# EAGLE design Amstrad-CPC-Z80-CTC-2-0 (EAGLE 9.6.2)
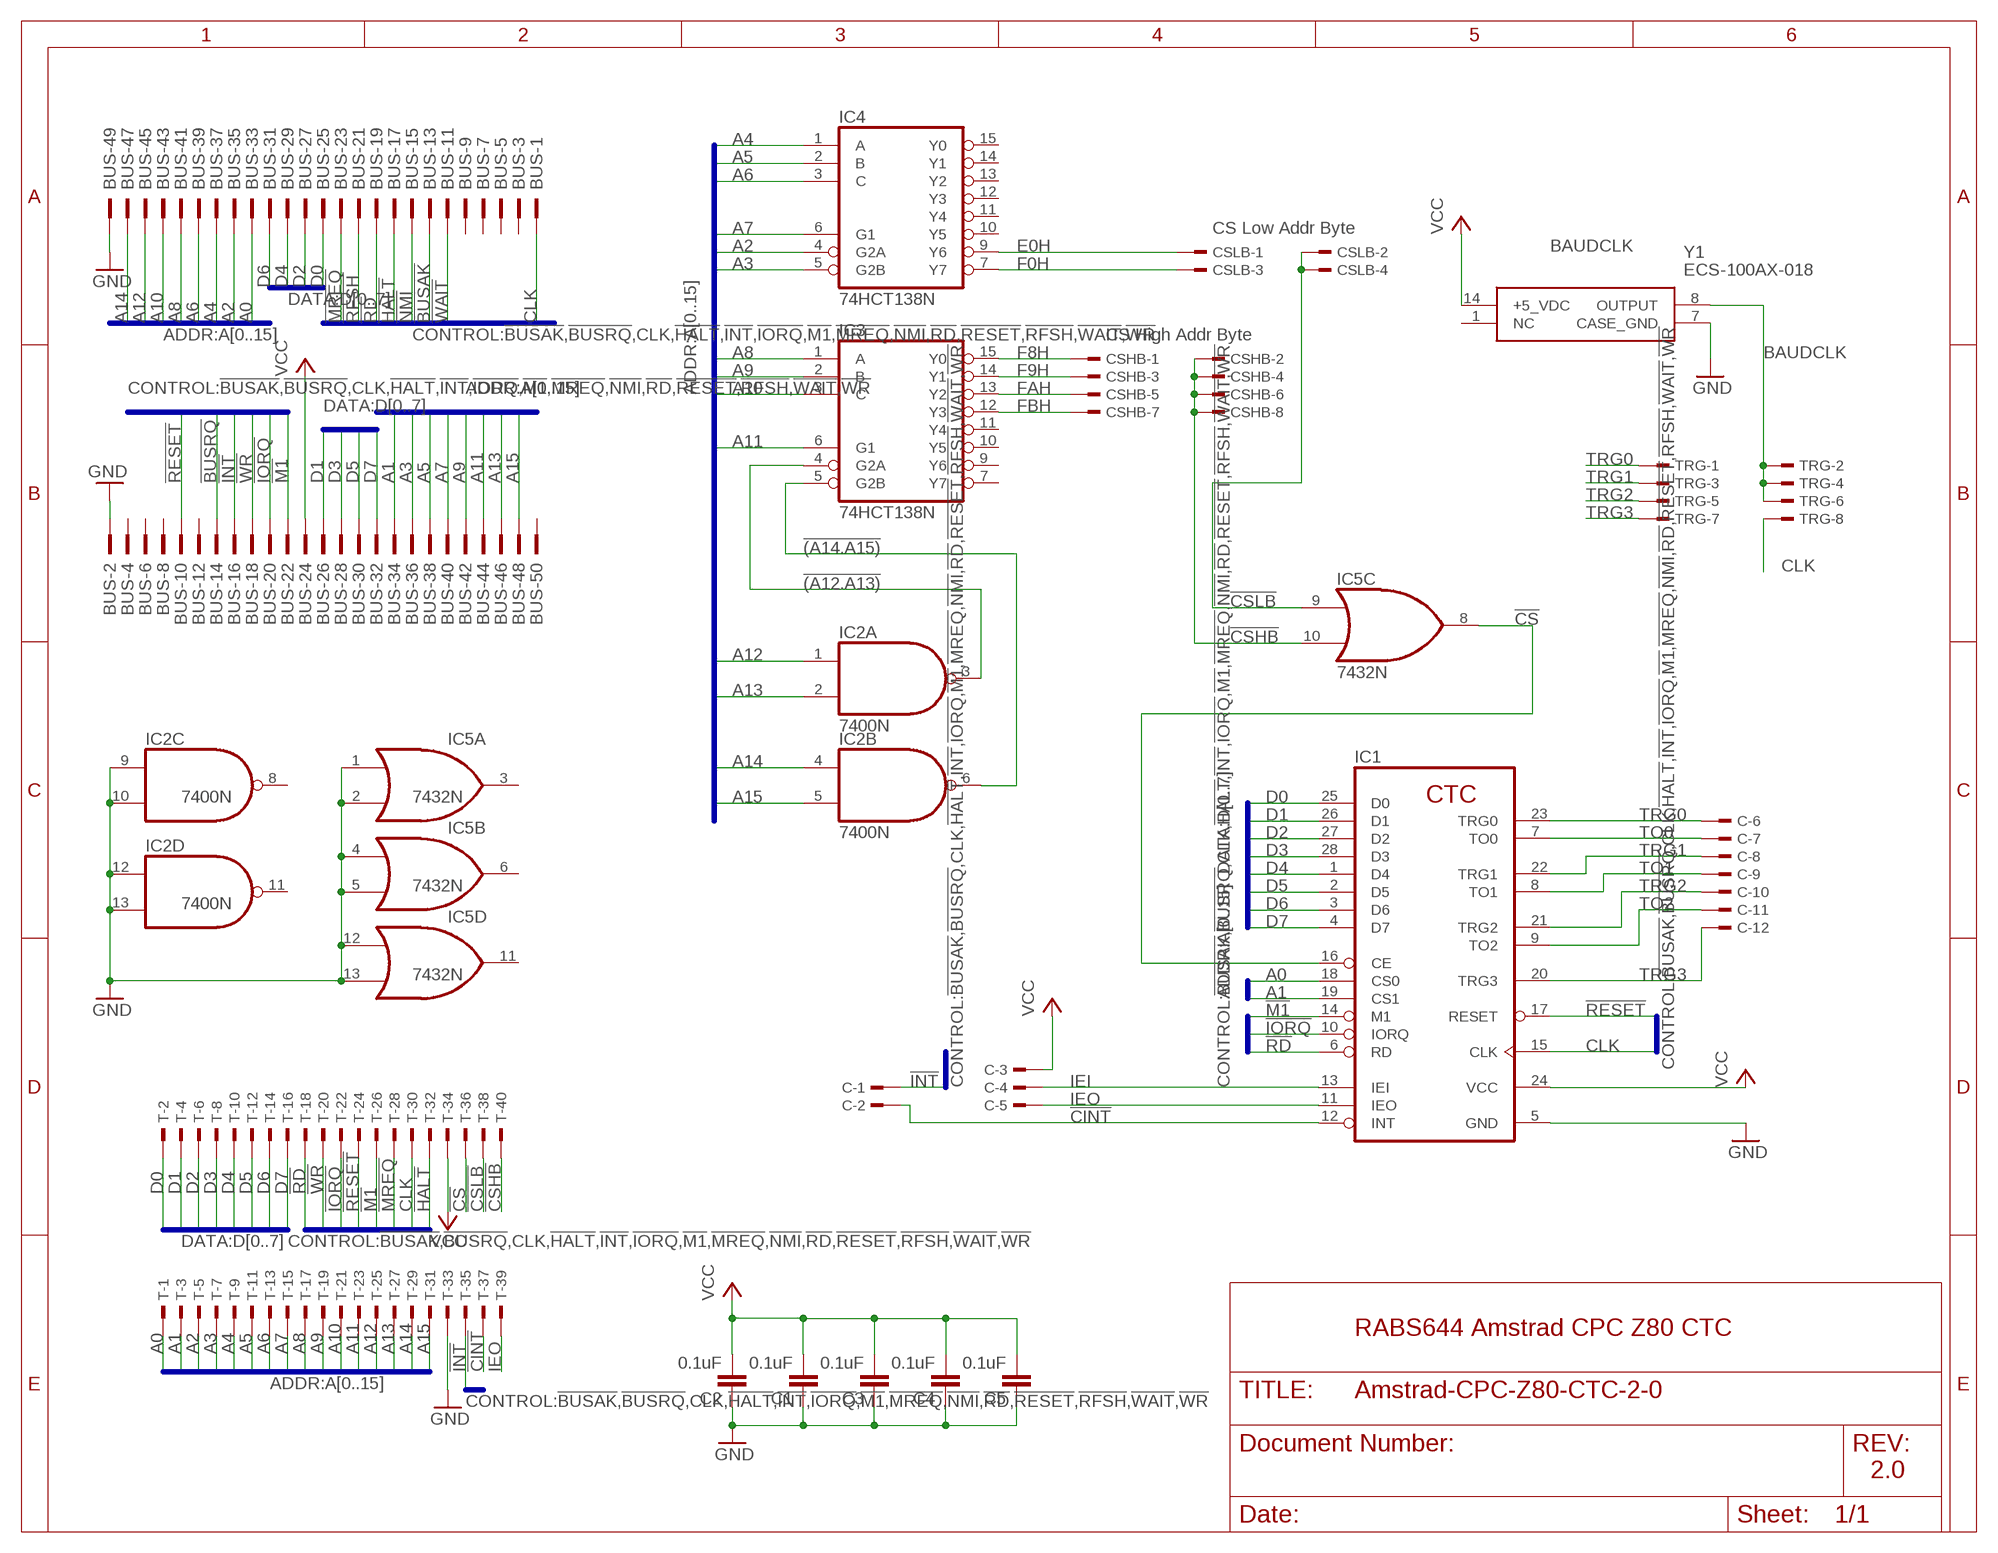
[diagram p0: schematic, sheet 1]

## Parts
BUS  2550-  [PAK100/2500-50]
C  TSW-112-07-G-S  [TSW-112-XX-G-S]
C1  0.1uF  C-EU050-025X075  [C050-025X075]
C2  0.1uF  C-EU050-025X075  [C050-025X075]
C3  0.1uF  C-EU050-025X075  [C050-025X075]
C4  0.1uF  C-EU050-025X075  [C050-025X075]
C5  0.1uF  C-EU050-025X075  [C050-025X075]
CSHB  TSW-104-07-G-D  [TSW-104-XX-G-D]
CSLB  TSW-102-07-G-D  [TSW-102-XX-G-D]
IC1  Z80CTC  [DIL28]
IC2  7400N  [DIL14]
IC3  74HCT138N  [DIL16]
IC4  74HCT138N  [DIL16]
IC5  7432N  [DIL14]
T  TSW-120-07-G-D  [TSW-120-XX-G-D]
TRG  TSW-104-07-G-D  [TSW-104-XX-G-D]
Y1  ECS-100AX-018  [ECS100AX018]

## Nets
!(A12.A13): IC2.3(A:O) IC3.4(G2A)
!(A14.A15): IC2.6(B:O) IC3.5(G2B)
!BUSAK: BUS.13
!BUSRQ: BUS.14
!CINT: C.2 IC1.12(INT) T.37
!CS: IC1.16(CE) IC5.8(C:O) T.36
!CSHB: CSHB.2 CSHB.4 CSHB.6 CSHB.8 IC5.10(C:I1) T.40
!CSLB: CSLB.2 CSLB.4 IC5.9(C:I0) T.38
!HALT: BUS.17 T.32
!INT: BUS.16 C.1 T.35
!IORQ: BUS.20 IC1.10(IORQ) T.22
!M1: BUS.22 IC1.14(M1) T.26
!MREQ: BUS.23 T.28
!NMI: BUS.15
!RD: BUS.19 IC1.6(RD) T.18
!RESET: BUS.10 IC1.17(RESET) T.24
!RFSH: BUS.21
!WAIT: BUS.11
!WR: BUS.18 T.20
A0: BUS.33 IC1.18(CS0) T.1
A1: BUS.34 IC1.19(CS1) T.3
A2: BUS.35 IC4.4(G2A) T.5
A3: BUS.36 IC4.5(G2B) T.7
A4: BUS.37 IC4.1(A) T.9
A5: BUS.38 IC4.2(B) T.11
A6: BUS.39 IC4.3(C) T.13
A7: BUS.40 IC4.6(G1) T.15
A8: BUS.41 IC3.1(A) T.17
A9: BUS.42 IC3.2(B) T.19
A10: BUS.43 IC3.3(C) T.21
A11: BUS.44 IC3.6(G1) T.23
A12: BUS.45 IC2.1(A:I0) T.25
A13: BUS.46 IC2.2(A:I1) T.27
A14: BUS.47 IC2.4(B:I0) T.29
A15: BUS.48 IC2.5(B:I1) T.31
BAUDCLK: TRG.2 TRG.4 TRG.6 Y1.8(OUTPUT)
CLK: BUS.1 IC1.15(CLK) T.30 TRG.8
D0: BUS.25 IC1.25(D0) T.2
D1: BUS.26 IC1.26(D1) T.4
D2: BUS.27 IC1.27(D2) T.6
D3: BUS.28 IC1.28(D3) T.8
D4: BUS.29 IC1.1(D4) T.10
D5: BUS.30 IC1.2(D5) T.12
D6: BUS.31 IC1.3(D6) T.14
D7: BUS.32 IC1.4(D7) T.16
E0H: CSLB.1 IC4.9(Y6)
F0H: CSLB.3 IC4.7(Y7)
F8H: CSHB.1 IC3.15(Y0)
F9H: CSHB.3 IC3.14(Y1)
FAH: CSHB.5 IC3.13(Y2)
FBH: CSHB.7 IC3.12(Y3)
GND [supply]: BUS.2 BUS.49 C1.1 C2.1 C3.1 C4.1 C5.1 IC1.5(GND) IC2.9(C:I0) IC2.10(C:I1) IC2.12(D:I0) IC2.13(D:I1) IC5.1(A:I0) IC5.2(A:I1) IC5.4(B:I0) IC5.5(B:I1) IC5.12(D:I0) IC5.13(D:I1) T.33 Y1.7(CASE_GND)
IEI: C.4 IC1.13(IEI)
IEO: C.5 IC1.11(IEO) T.39
TO0: C.7 IC1.7(TO0)
TO1: C.9 IC1.8(TO1)
TO2: C.11 IC1.9(TO2)
TRG0: C.6 IC1.23(TRG0) TRG.1
TRG1: C.8 IC1.22(TRG1) TRG.3
TRG2: C.10 IC1.21(TRG2) TRG.5
TRG3: C.12 IC1.20(TRG3) TRG.7
VCC [supply]: BUS.24 C1.2 C2.2 C3.2 C4.2 C5.2 C.3 IC1.24(VCC) T.34 Y1.14(+5_VDC)
Unconnected: BUS.3 BUS.4 BUS.5 BUS.6 BUS.7 BUS.8 BUS.9 BUS.12 BUS.50 IC2.8(C:O) IC2.11(D:O) IC3.7(Y7) IC3.9(Y6) IC3.10(Y5) IC3.11(Y4) IC4.10(Y5) IC4.11(Y4) IC4.12(Y3) IC4.13(Y2) IC4.14(Y1) IC4.15(Y0) IC5.3(A:O) IC5.6(B:O) IC5.11(D:O) Y1.1(NC)

## Buses
ADDR:A[0..15]
DATA:D[0..7]
CONTROL:!BUSAK,!BUSRQ,CLK,!HALT,!INT,!IORQ,!M1,!MREQ,!NMI,!RD,!RESET,!RFSH,!WAIT,!WR

## Notes on the sheet
- CS Low Addr Byte
- BAUDCLK
- CS High Addr Byte
- RABS644 Amstrad CPC Z80 CTC
- 2.0

## Power pins joined to a net without a drawn wire
GND: IC2.7(P:GND) IC3.8(GND) IC4.8(GND) IC5.7(P:GND)
VCC: IC2.14(P:VCC) IC3.16(VCC) IC4.16(VCC) IC5.14(P:VCC)

## Library data of the parts
BUS = con-3m:2550-: 3M (TM) Pak 100 4-Wall Header Source: 3M; OC_FARNELL: unknown; OC_NEWARK: unknown; SPICEPREFIX: X
C = con-samtec:TSW-112-*-G-S: THROUGH-HOLE .025" SQ POST HEADER Source: Samtec TSW.pdf; MF: Samtec Inc.; MPN: TSW-112-07-G-S
C1-C5 = rcl:C-EU: CAPACITOR, European symbol; SPICEPREFIX: C
CSHB TRG = con-samtec:TSW-104-*-G: THROUGH-HOLE .025" SQ POST HEADER Source: Samtec TSW.pdf; MF: Samtec Inc.; MPN: TSW-104-07-G-D
CSLB = con-samtec:TSW-102-*-G: THROUGH-HOLE .025" SQ POST HEADER Source: Samtec TSW.pdf; MF: Samtec Inc.; MPN: TSW-102-07-G-D
IC1 = zilog:Z80CTC: Z80 FAMILY DEVICE
IC2 = 74xx-us:74*00: Quad 2-input NAND gate
IC3 IC4 = 74xx-eu:74*138: 3-line to 8-line DECODER/DEMULTIPLEXER
IC5 = 74xx-us:74*32: Quad 2-input OR gate
T = con-samtec:TSW-120-*-G: THROUGH-HOLE .025" SQ POST HEADER Source: Samtec TSW.pdf; MF: Samtec Inc.; MPN: TSW-120-07-G-D
Y1 = ECS-100AX-018:ECS-100AX-018: Standard Clock Oscillators DIP-14 5V 1.8432MHz Source: Datasheet <https://ecsxtal.com/store/pdf/ecs-100x.pdf>; ARROW_PART_NUMBER: ECS-100AX-018; ARROW_PRICE-STOCK: https://www.arrow.com/en/products/ecs-100ax-018/ecs-international?region=nac; DESCRIPTION: Standard Clock Oscillators DIP-14 5V 1.8432MHz; HEIGHT: 5.08mm; MANUFACTURER_NAME: ECS; MANUFACTURER_PART_NUMBER: ECS-100AX-018; MOUSER_PART_NUMBER: 520-TCF184-X; MOUSER_PRICE-STOCK: https://www.mouser.co.uk/ProductDetail/ECS/ECS-100AX-018?qs=GxOUx7aO6ny8sWJWBQEujw%3D%3D

## Net classes
0 default: width 0.254 mm, clearance 0.254 mm
1 supply: width 0.508 mm, clearance 0.508 mm

## Board
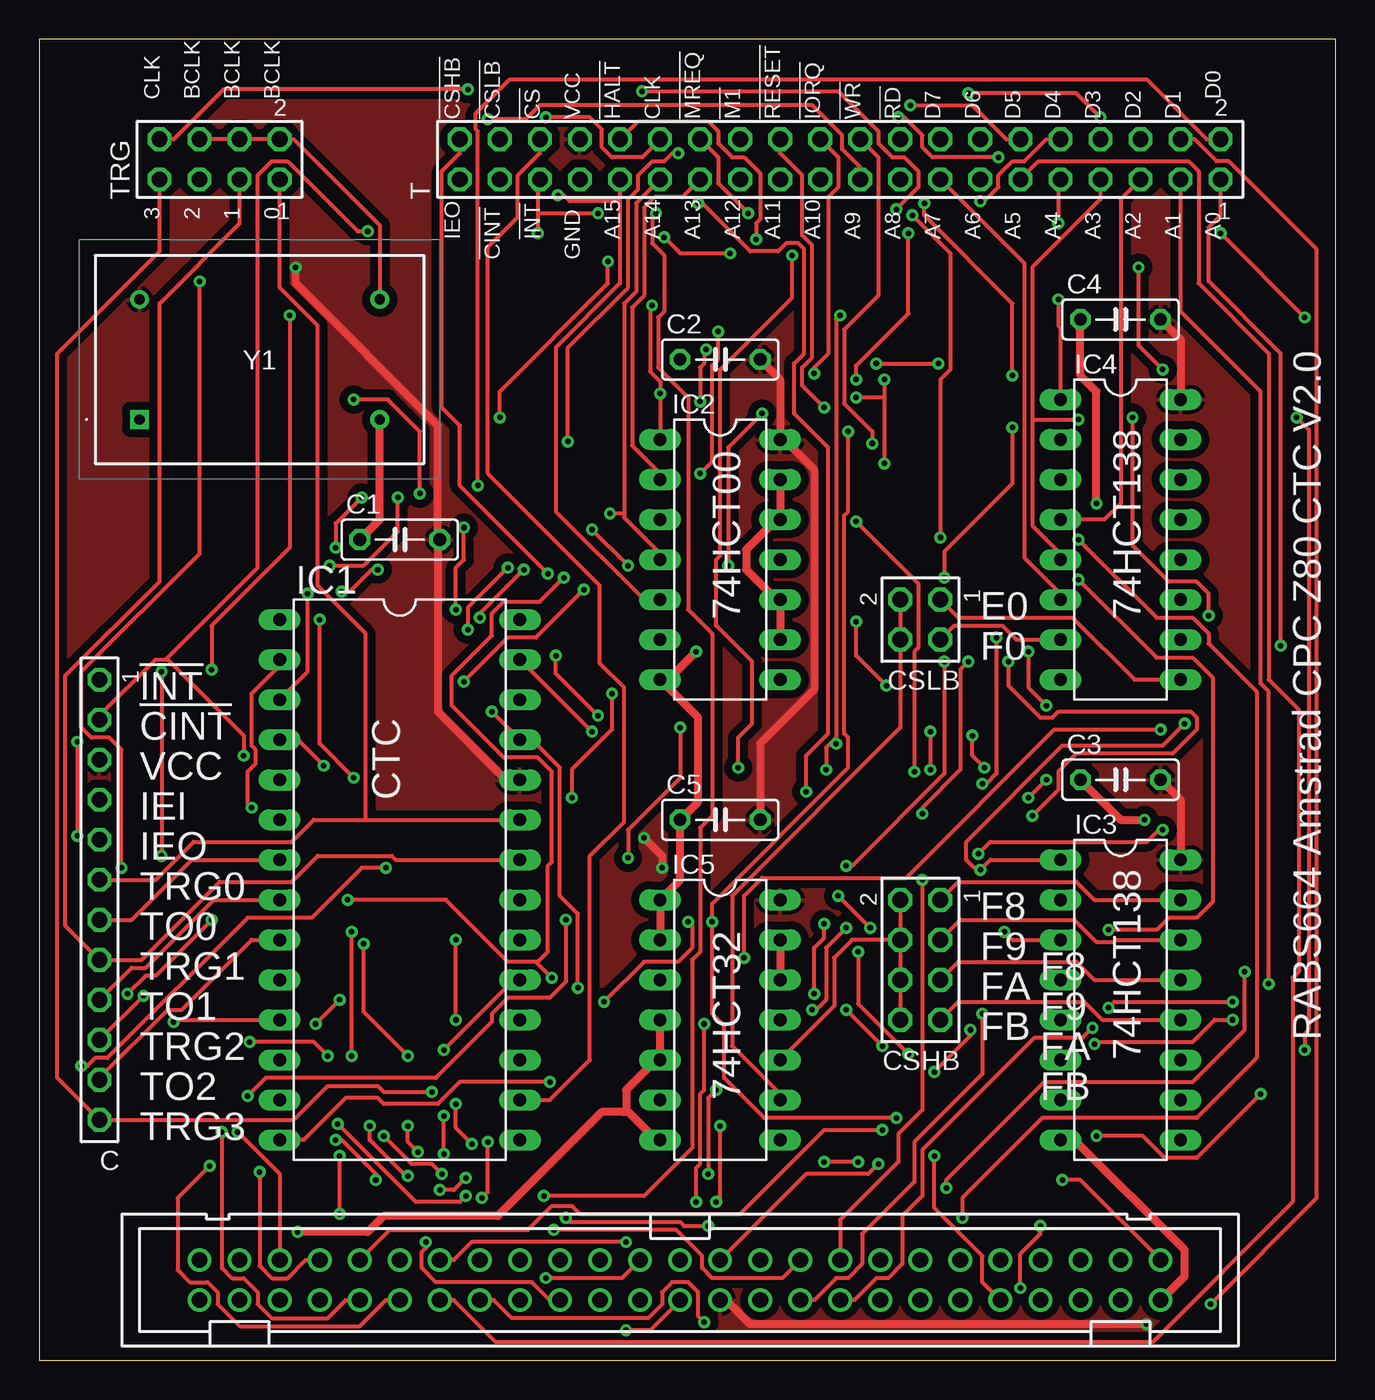
[diagram p1: board, top side]
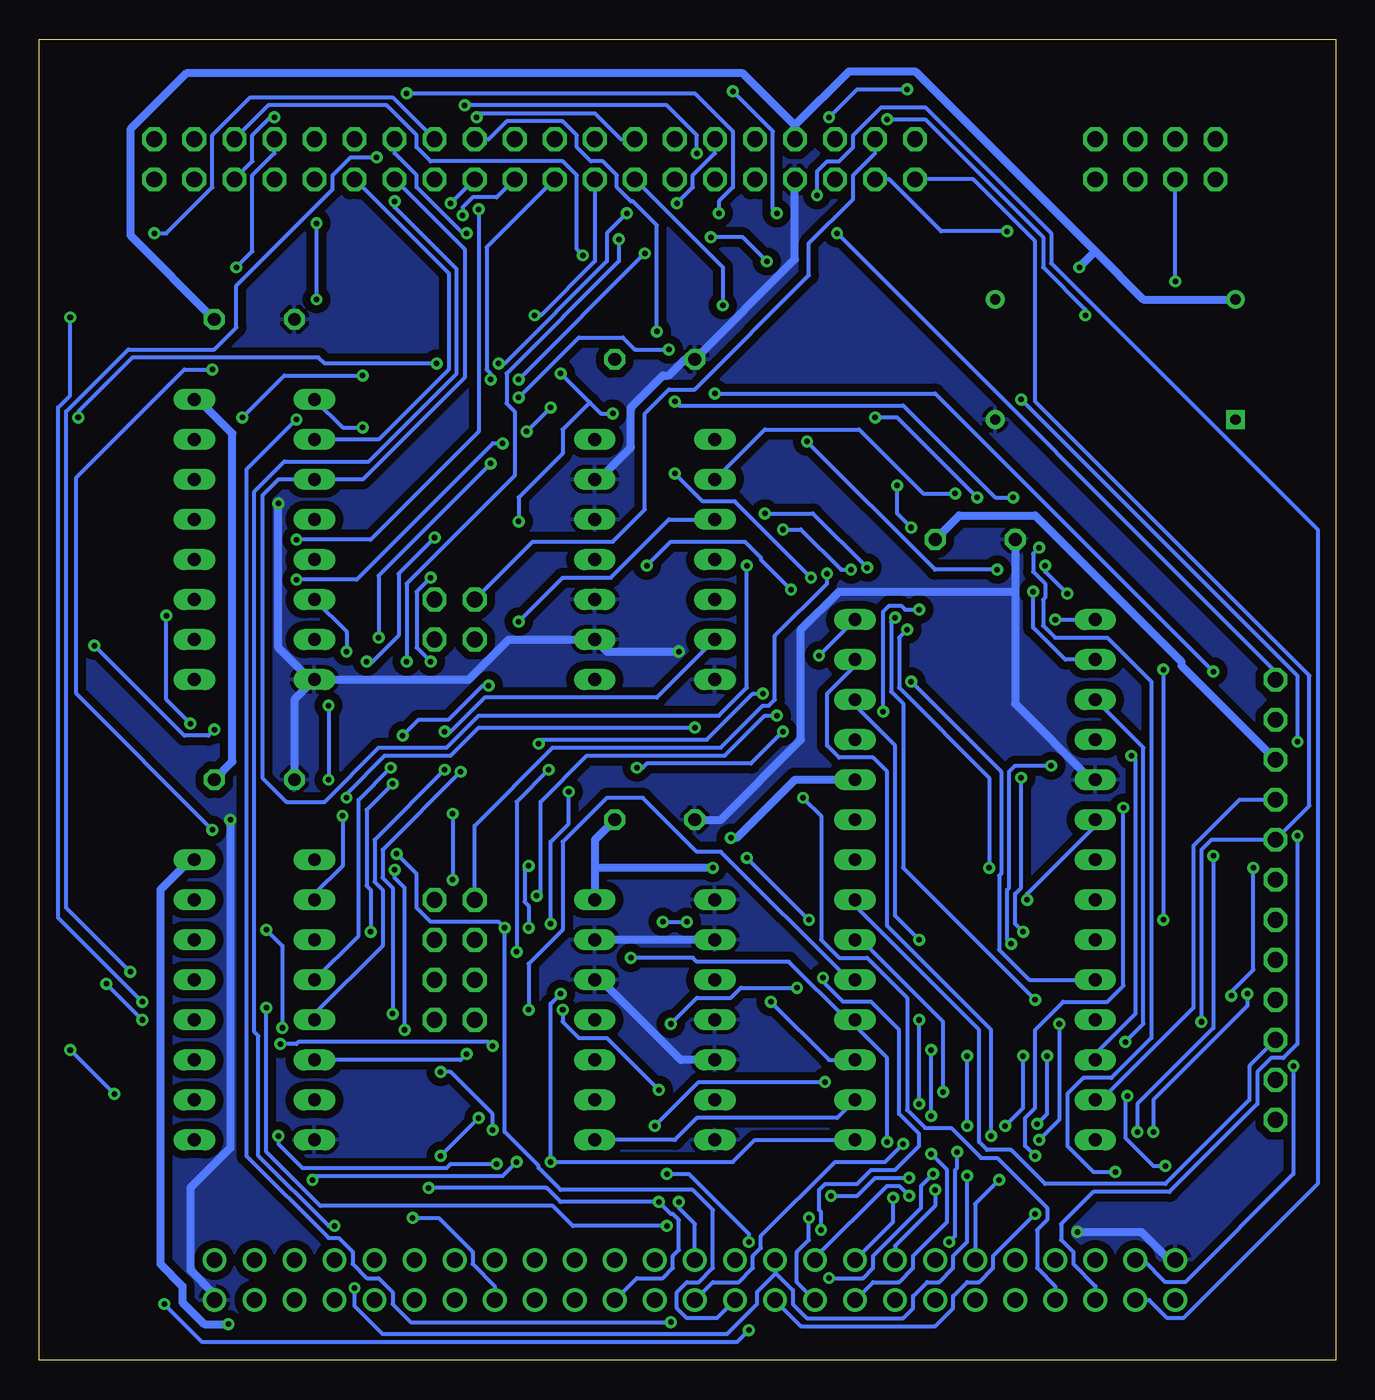
[diagram p2: board, bottom side, seen from below]

Size 82.22 x 83.81 mm. Coordinates in mm from the lower left corner, seen from the top.
Outline: 0,0 82.22,0 82.22,83.81 0,83.81 0,0
Copper layers (1*16): Top 0.035mm / dielectric 1.5mm / Bottom 0.035mm
Design rules "default": minimum track width 6mil, minimum drill 0.35mm, track to track 6mil, track to pad 6mil, pad to pad 6mil, via to via 6mil, smd to smd 6mil, copper to edge 40mil, drill to drill 6mil, minimum pad ring 10mil, minimum via ring 8mil, stop-mask expansion 4mil, vias tented up to drill 0mil, thermal gap 10mil

### Footprints (pad centres in the part's own frame; a part is rotated, then mirrored left to right if it is on the bottom)
PAK100/2500-50 = drill 1 pad 1.422: 1 -30.48,-1.27; 2 -30.48,1.27; 3 -27.94,-1.27; 4 -27.94,1.27; 5 -25.4,-1.27; 6 -25.4,1.27; 7 -22.86,-1.27; 8 -22.86,1.27; 9 -20.32,-1.27; 10 -20.32,1.27; 11 -17.78,-1.27; 12 -17.78,1.27; 13 -15.24,-1.27; 14 -15.24,1.27; 15 -12.7,-1.27; 16 -12.7,1.27; 17 -10.16,-1.27; 18 -10.16,1.27; 19 -7.62,-1.27; 20 -7.62,1.27; 21 -5.08,-1.27; 22 -5.08,1.27; 23 -2.54,-1.27; 24 -2.54,1.27; 25 0,-1.27; 26 0,1.27; 27 2.54,-1.27; 28 2.54,1.27; 29 5.08,-1.27; 30 5.08,1.27; 31 7.62,-1.27; 32 7.62,1.27; 33 10.16,-1.27; 34 10.16,1.27; 35 12.7,-1.27; 36 12.7,1.27; 37 15.24,-1.27; 38 15.24,1.27; 39 17.78,-1.27; 40 17.78,1.27; 41 20.32,-1.27; 42 20.32,1.27; 43 22.86,-1.27; 44 22.86,1.27; 45 25.4,-1.27; 46 25.4,1.27; 47 27.94,-1.27; 48 27.94,1.27; 49 30.48,-1.27; 50 30.48,1.27
TSW-112-XX-G-S = drill 1 pad 1.5 octagon: 1 13.97,0; 2 11.43,0; 3 8.89,0; 4 6.35,0; 5 3.81,0; 6 1.27,0; 7 -1.27,0; 8 -3.81,0; 9 -6.35,0; 10 -8.89,0; 11 -11.43,0; 12 -13.97,0
C050-025X075 = drill 0.813 octagon: 1 -2.54,0; 2 2.54,0
TSW-104-XX-G-D = drill 1 pad 1.5 octagon: 1 3.81,-1.27; 2 3.81,1.27; 3 1.27,-1.27; 4 1.27,1.27; 5 -1.27,-1.27; 6 -1.27,1.27; 7 -3.81,-1.27; 8 -3.81,1.27
TSW-102-XX-G-D = drill 1 pad 1.5 octagon: 1 1.27,-1.27; 2 1.27,1.27; 3 -1.27,-1.27; 4 -1.27,1.27
DIL28 = drill 0.813 long: 1 -16.51,-7.62; 2 -13.97,-7.62; 3 -11.43,-7.62; 4 -8.89,-7.62; 5 -6.35,-7.62; 6 -3.81,-7.62; 7 -1.27,-7.62; 8 1.27,-7.62; 9 3.81,-7.62; 10 6.35,-7.62; 11 8.89,-7.62; 12 11.43,-7.62; 13 13.97,-7.62; 14 16.51,-7.62; 15 16.51,7.62; 16 13.97,7.62; 17 11.43,7.62; 18 8.89,7.62; 19 6.35,7.62; 20 3.81,7.62; 21 1.27,7.62; 22 -1.27,7.62; 23 -3.81,7.62; 24 -6.35,7.62; 25 -8.89,7.62; 26 -11.43,7.62; 27 -13.97,7.62; 28 -16.51,7.62
DIL14 = drill 0.813 long: 1 -7.62,-3.81; 2 -5.08,-3.81; 3 -2.54,-3.81; 4 0,-3.81; 5 2.54,-3.81; 6 5.08,-3.81; 7 7.62,-3.81; 8 7.62,3.81; 9 5.08,3.81; 10 2.54,3.81; 11 0,3.81; 12 -2.54,3.81; 13 -5.08,3.81; 14 -7.62,3.81
DIL16 = drill 0.813 long: 1 -8.89,-3.81; 2 -6.35,-3.81; 3 -3.81,-3.81; 4 -1.27,-3.81; 5 1.27,-3.81; 6 3.81,-3.81; 7 6.35,-3.81; 8 8.89,-3.81; 9 8.89,3.81; 10 6.35,3.81; 11 3.81,3.81; 12 1.27,3.81; 13 -1.27,3.81; 14 -3.81,3.81; 15 -6.35,3.81; 16 -8.89,3.81
TSW-120-XX-G-D = drill 1 pad 1.5 octagon: 1 24.13,-1.27; 2 24.13,1.27; 3 21.59,-1.27; 4 21.59,1.27; 5 19.05,-1.27; 6 19.05,1.27; 7 16.51,-1.27; 8 16.51,1.27; 9 13.97,-1.27; 10 13.97,1.27; 11 11.43,-1.27; 12 11.43,1.27; 13 8.89,-1.27; 14 8.89,1.27; 15 6.35,-1.27; 16 6.35,1.27; 17 3.81,-1.27; 18 3.81,1.27; 19 1.27,-1.27; 20 1.27,1.27; 21 -1.27,-1.27; 22 -1.27,1.27; 23 -3.81,-1.27; 24 -3.81,1.27; 25 -6.35,-1.27; 26 -6.35,1.27; 27 -8.89,-1.27; 28 -8.89,1.27; 29 -11.43,-1.27; 30 -11.43,1.27; 31 -13.97,-1.27; 32 -13.97,1.27; 33 -16.51,-1.27; 34 -16.51,1.27; 35 -19.05,-1.27; 36 -19.05,1.27; 37 -21.59,-1.27; 38 -21.59,1.27; 39 -24.13,-1.27; 40 -24.13,1.27
ECS100AX018 = drill 0.65 pad 1.192 square: 1 0,0 | drill 0.65 pad 1.192: 7 15.24,0; 8 15.24,7.62; 14 0,7.62

### Placement (x,y rotation side)
BUS  40.64,5.08 180 top
C  3.81,29.21 90 top
C1  22.86,52.07 0 top
C2  43.18,63.5 0 top
C3  68.58,36.83 0 top
C4  68.58,66.04 0 top
C5  43.18,34.29 0 top
CSHB  55.88,25.4 90 top
CSLB  55.88,46.99 90 top
IC1  22.86,30.48 270 top
IC2  43.18,50.8 270 top
IC3  68.58,22.86 270 top
IC4  68.58,52.07 270 top
IC5  43.18,21.59 270 top
T  50.8,76.2 0 top
TRG  11.43,76.2 0 top
Y1  6.35,59.69 0 top

### Tracks (layer width: path | path; a pad name or v marks a point on that pad's centre or on a via)
!(A12.A13)  (via drill 0.35)
  Top 0.254: v51.82,46.86 51.82,44.7 v53.72,42.8 | v59.18,39.62 59.18,38.35 v59.94,37.59
  Bottom 0.254: IC2.3 42.29,53.34 45.97,49.66 49.02,49.66 v51.82,46.86 | v53.72,42.8 54.1,42.8 56.26,40.64 58.17,40.64 v59.18,39.62 | v59.94,37.59 61.98,35.56 61.98,26.92 IC3.4
!(A14.A15)  (via drill 0.35)
  Top 0.254: v56.52,39.88 v56.52,37.47
  Bottom 0.254: IC3.5 64.77,21.97 60.45,26.29 60.45,29.84 60.96,30.35 60.96,33.02 v56.52,37.47 | v56.52,39.88 56.13,39.88 53.98,42.04 43.05,42.04 IC2.6
!CINT  (via drill 0.35)
  Top 0.254: v12.95,38.35 12.95,39.62 8.13,44.45 8,44.45 | 8,44.45 7.37,44.45 3.81,40.89 C.2 | v20.83,71.63 20.19,71.63 15.75,76.07 14.73,76.07 13.84,75.18 13.84,50.29 8,44.45
  Bottom 0.254: IC1.12 15.24,19.43 12.7,21.97 12.7,38.1 v12.95,38.35 | T.37 28.32,74.93 25.02,71.63 v20.83,71.63
!CS
  Top 0.254: T.36 31.75,76.58 30.35,75.18 30.35,72.52 28.45,70.61 28.45,56.26 35.56,49.15 35.56,44.2 37.08,42.67 37.08,34.16 34.92,32 34.92,19.05 32.38,16.51 IC1.16
  Bottom 0.254: IC5.8 41.91,13.97 40.51,15.37 31.62,15.37 IC1.16
!CSHB  (via drill 0.35)
  Top 0.254: CSHB.8 CSHB.6 CSHB.4 | IC5.10 50.42,22.48 50.42,25.53 51.56,26.67 CSHB.4 | T.40 26.67,76.58 25.53,75.44 25.53,60.45 26.67,59.31 26.67,55.5 v32.26,49.91 | CSHB.2 CSHB.4
  Bottom 0.254: v32.26,49.91 32.26,49.28 35.56,45.97 35.56,41.91 35.94,41.53 36.32,41.53 38.99,38.86 49.66,38.86 54.61,33.91 CSHB.2
!CSLB
  Top 0.254: IC5.9 46.99,16.89 43.94,19.94 43.94,29.46 54.61,40.13 CSLB.4 CSLB.2
  Bottom 0.254: T.38 29.21,76.58 30.61,75.18 30.61,73.66 33.4,70.87 33.4,68.83 40.64,61.59 42.29,61.59 43.81,60.07 43.81,53.98 45.85,51.94 50.93,51.94 CSLB.2
!HALT  (via drill 0.35)
  Top 0.254: BUS.17 50.8,8.89 54.48,12.57 54.48,14.35 56.01,15.88 v56.01,30.48 | v56.01,34.67 56.01,35.05 58.42,37.47 58.42,43.81 v58.93,44.32 | v45.47,71.12 45.47,72.14 45.72,72.39 45.72,75.31 44.7,76.33 43.94,76.33 43.05,77.22 43.05,77.98 42.42,78.61 37.97,78.61 T.32
  Bottom 0.254: v56.01,34.67 v56.01,30.48 | v58.93,44.32 58.93,49.28 52.07,56.13 52.07,60.2 52.58,60.71 52.58,62.61 45.47,69.72 v45.47,71.12
!INT  (via drill 0.35)
  Top 0.254: 31.62,72.77 31.62,74.8 T.35 | 31.62,72.77 v31.62,71.5 | v58.55,9.02 58.55,10.29 63.63,15.37 73.41,15.37 77.22,19.18 77.22,42.42 74.17,45.47 74.17,46.1 73.15,47.12 70.87,47.12 v65.91,52.07 | v54.36,73.03 55.75,74.42 55.75,75.44 54.86,76.33 54.1,76.33 53.21,77.22 53.21,77.98 50.67,80.52 v38.23,80.52 | 31.62,72.77 v35.43,72.77
  Bottom 0.254: C.1 3.81,43.69 v31.62,71.5 | BUS.16 53.34,4.7 54.74,6.1 54.74,6.86 56.9,9.02 v58.55,9.02 | v65.91,52.07 61.21,52.07 54.36,58.93 v54.36,73.03 | v38.23,80.52 35.69,77.98 35.69,73.03 v35.43,72.77
!IORQ  (via drill 0.35)
  Top 0.254: v26.92,43.05 29.72,45.85 31.5,45.85 v34.54,48.9 | v43.69,50.42 43.69,57.91 v45.85,60.07 | v49.15,62.61 49.15,62.99 50.04,63.88 50.04,73.79 50.67,74.42 50.67,76.33 T.22 | BUS.20 49.15,3.81 50.55,5.21 51.31,5.21 52.2,6.1 52.2,8 55.5,11.3 55.5,13.84 59.82,18.16 v59.82,21.97 | v55.5,37.34 55.5,44.96 55.75,45.21 55.75,49.28 v51.82,53.21
  Bottom 0.254: IC1.10 19.43,24.13 21.34,26.04 21.34,30.73 21.21,30.86 21.21,37.34 v26.92,43.05 | v34.54,48.9 36.45,50.8 36.45,50.93 37.47,51.94 42.16,51.94 v43.69,50.42 | v45.85,60.07 46.61,60.07 47.31,60.77 | v49.15,62.61 47.31,60.77 | v59.82,21.97 59.82,29.97 60.45,30.61 60.45,32.38 v55.5,37.34 | v51.82,53.21 51.82,54.74 49.02,57.53 49.02,59.05 47.31,60.77
!M1  (via drill 0.35)
  Top 0.254: IC1.14 16.76,13.97 19.43,16.64 21.46,16.64 21.84,16.26 25.27,16.26 26.67,17.65 v32.38,17.65 | v43.18,14.86 43.18,10.29 v42.93,10.03 | v54.48,78.87 54.86,78.87 56.01,77.72 56.01,76.96 56.64,76.33 v60.83,76.33 | v76.45,24.64 76.45,20.95 73.15,17.65 63.75,17.65 57.53,11.43 v57.53,10.92
  Bottom 0.254: v32.38,17.65 40.39,17.65 v43.18,14.86 | BUS.22 44.32,5.21 42.67,5.21 42.04,5.84 42.04,6.6 41.66,6.99 41.66,8.89 42.04,9.27 42.16,9.27 v42.93,10.03 49.15,10.03 50.04,10.92 v57.53,10.92 | T.26 45.34,77.47 46.99,79.12 54.23,79.12 v54.48,78.87 | v60.83,76.33 62.48,76.33 63.63,75.18 63.63,74.3 69.72,68.2 69.72,65.53 71.12,64.14 76.58,64.14 80.52,60.2 80.52,28.7 v76.45,24.64
!MREQ  (via drill 0.35)
  Top 0.254: BUS.23 48.64,11.81 52.58,11.81 v53.21,12.45 | v67.06,14.22 69.98,14.22 71.37,12.83 73.41,12.83 v77.47,16.89 | v80.26,19.68 80.26,20.7 80.52,20.95 80.52,59.05 v79.76,59.82 | v53.09,63.25 v57.02,63.25 | v44.96,72.77 43.05,74.68 43.05,76.33 T.28
  Bottom 0.254: v53.21,12.45 56.13,12.45 56.39,12.19 65.53,12.19 67.06,13.72 v67.06,14.22 | v80.26,19.68 v77.47,16.89 | v79.76,59.82 79.76,60.2 76.33,63.63 64.52,63.63 64.14,63.25 v57.02,63.25 | v53.09,63.25 52.7,63.25 46.23,69.72 46.23,71.5 v44.96,72.77
!RD  (via drill 0.35)
  Top 0.254: v19.56,29.21 25.78,29.21 29.72,25.27 31.5,25.27 31.56,25.21 | v32.51,24.26 31.56,25.21 | v32.64,8.26 40.39,8.26 42.04,6.6 42.04,5.84 42.67,5.21 47.12,5.21 BUS.19 | v43.05,65.28 43.05,63.5 42.67,63.12 42.67,57.02 v41.91,56.26 | v33.27,49.66 31.75,48.13 29.46,48.13 28.7,47.37 28.7,45.97 26.16,43.43 26.16,41.53 29.46,38.23 31.62,38.23 32.51,37.34 32.51,31.62 32.26,31.37 32.26,25.91 31.56,25.21
  Bottom 0.254: IC1.6 15.24,33.91 19.56,29.59 v19.56,29.21 | v32.51,24.26 32.51,24 31.24,22.73 29.46,22.73 27.69,20.95 27.69,15.62 26.42,14.35 26.42,13.59 27.94,12.06 29.46,12.06 30.35,11.18 32.38,11.18 32.77,10.79 32.77,9.53 32.64,9.4 v32.64,8.26 | T.18 53.72,77.47 52.58,78.61 49.02,78.61 48.13,77.72 48.13,76.96 47.24,76.07 46.48,76.07 45.59,75.18 45.59,74.42 44.7,73.53 44.58,73.53 43.05,72.01 v43.05,65.28 | v41.91,56.26 40.13,54.48 38.1,54.48 v33.27,49.66
!RESET  (via drill 0.35)
  Top 0.254: v35.81,22.73 38.35,25.27 40.51,25.27 41.4,26.16 41.4,27.56 v41.15,27.81 | v54.36,15.37 45.97,15.37 43.43,17.91 43.43,21.21 42.67,21.97 v42.67,27.81 42.67,28.96 51.31,37.59 51.31,39.5 51.05,39.75 51.05,53.59 51.31,53.85 v51.31,58.93 | v56.77,12.95 56.77,9.65 59.82,6.6 59.82,4.95 BUS.10 | T.24 46.99,76.58 48.39,75.18 48.39,71.37 49.02,70.74 49.02,63.63 48.39,62.99 48.39,61.85 v49.78,60.45
  Bottom 0.254: IC1.17 32.13,19.05 v35.81,22.73 | v42.67,27.81 v41.15,27.81 | v56.77,12.95 v54.36,15.37 | v51.31,58.93 v49.78,60.45
!WR  (via drill 0.35)
  Top 0.254: BUS.18 51.69,3.81 53.09,5.21 53.85,5.21 54.74,6.1 54.74,9.14 56.01,10.41 56.01,13.34 63.12,20.45 66.17,20.45 v66.8,21.08 | v67.82,27.3 70.87,27.3 71.63,28.07 73.41,28.07 74.42,29.08 74.42,43.31 73.15,44.58 70.87,44.58 v65.91,49.53 | v52.83,58.17 52.83,58.93 51.05,60.71 51.05,65.41 53.21,67.56 53.21,76.33 T.20
  Bottom 0.254: v66.8,21.08 66.8,26.29 v67.82,27.3 | v65.91,49.53 62.1,49.53 53.47,58.17 v52.83,58.17
A0  (via drill 0.35)
  Top 0.254: v28.45,13.84 28.45,10.67 v28.07,10.29 | T.1 74.93,72.64 74.17,71.88 74.17,68.45 78.74,63.88 v78.74,45.34 | v71.12,40.01 64.39,40.01 54.99,30.61 45.85,30.61 44.7,29.46 v44.7,25.53
  Bottom 0.254: v28.45,13.84 28.45,19.18 30.48,21.21 IC1.18 30.99,21.59 34.67,25.27 40.51,25.27 40.77,25.53 v44.7,25.53 | v28.07,10.29 28.07,8.76 BUS.33 | v78.74,45.34 73.03,39.62 71.5,39.62 v71.12,40.01
A1  (via drill 0.35)
  Top 0.254: IC1.19 30.1,24.13 v25.65,19.68 | v25.65,13.08 v25.65,15.49 | T.3 72.39,66.55 77.47,61.47 77.47,42.93 77.98,42.42 v77.98,23.88 | v75.69,21.59 74.55,21.59 73.15,20.19 67.06,20.19 v66.93,20.07 | v51.18,22.23 v53.47,19.94
  Bottom 0.254: v25.65,15.49 v25.65,19.68 | v25.65,13.08 24.64,12.06 24.64,8.76 26.8,6.6 26.8,5.84 27.69,4.95 29.34,4.95 BUS.34 | v75.69,21.59 v77.98,23.88 | v66.93,20.07 65.91,20.07 65.79,20.19 53.72,20.19 v53.47,19.94 | v51.18,22.23 51.18,25.15 49.02,27.3 49.02,32.89 46.23,35.69 43.94,35.69 40.51,32.26 38.99,32.26 30.86,24.13 IC1.19
A2  (via drill 0.35)
  Top 0.254: IC4.4 67.56,53.34 68.58,54.36 68.58,73.66 T.5 | v25.4,10.79 26.29,10.79 v27.05,11.56 | v32,10.41 38.35,10.41 41.4,13.46 41.4,25.4 41.91,25.91 41.91,33.78 42.67,34.54 42.67,46.1 41.15,47.62 41.15,61.09 39.24,62.99 39.24,66.17 39.62,66.55 39.62,70.1 38.86,70.87 38.86,72.52 v39.12,72.77 | v58.93,80.39 65.79,80.39 v67.31,78.87
  Bottom 0.254: BUS.35 27.94,7.24 25.4,9.78 v25.4,10.79 | v27.05,11.56 29.21,11.56 30.35,10.41 v32,10.41 | v39.12,72.77 39.12,73.53 38.23,74.42 38.23,77.98 40.64,80.39 v58.93,80.39 | v67.31,78.87 67.56,78.87 68.71,77.72 68.71,76.07 T.5
A3  (via drill 0.35)
  Top 0.254: IC4.5 64.77,51.18 62.99,52.96 62.99,59.69 | 62.99,59.69 62.99,69.34 67.31,73.66 T.7 | BUS.36 28.83,3.81 29.97,2.67 38.61,2.67 39.5,3.56 39.5,4.32 40.13,4.95 41.15,4.95 41.78,4.32 41.78,2.79 v42.16,2.41 | 62.99,59.69 v65.91,59.69
  Bottom 0.254: v42.16,2.41 58.67,2.41 59.82,3.56 59.82,4.32 60.71,5.21 61.47,5.21 62.36,6.1 62.36,6.86 63.25,7.75 63.88,7.75 69.09,12.95 69.09,56.52 v65.91,59.69
A4  (via drill 0.35)
  Top 0.254: IC4.1 64.77,65.53 64.64,65.66 v64.64,67.31 | v64.64,72.14 64.64,74.8 T.9 | BUS.37 26.29,6.35 27.43,7.49 v37.21,7.49 | v42.42,11.81 42.42,16.64 v42.93,17.14 | v49.02,22.23 49.28,22.23 49.91,22.86 49.91,26.16 v51.18,27.43 | v51.18,31.37 51.56,31.37 57.4,37.21 v57.4,44.32 | v57.4,49.66 57.4,51.31 61.72,55.63 v61.72,59.18
  Bottom 0.254: v64.64,72.14 v64.64,67.31 | v37.21,7.49 37.21,8 41.02,11.81 v42.42,11.81 | v42.93,17.14 46.23,20.45 48.01,20.45 49.02,21.46 v49.02,22.23 | v51.18,27.43 51.18,28.83 51.44,29.08 51.44,31.11 v51.18,31.37 | v57.4,44.32 58.29,45.21 58.29,48.77 v57.4,49.66 | v61.72,59.18 62.99,59.18 IC4.1
A5
  Top 0.254: BUS.38 26.29,3.81 28.96,1.14 70.61,1.14 79.5,10.03 79.5,24.26 79.88,24.64 79.88,41.27 77.98,43.18 77.98,63.88 73.53,68.33 73.53,75.44 72.9,76.07 63.37,76.07 T.11
  Bottom 0.254: IC4.2 60.71,58.42 56.26,62.87 56.26,68.96 T.11
A6  (via drill 0.35)
  Top 0.254: v21.34,11.43 21.34,11.81 19.18,13.97 v18.8,13.97 | v19.05,22.86 v17.53,21.34 | v27.94,47.12 27.94,47.37 v30.73,50.16 | v37.34,50.42 v35.05,52.7
  Bottom 0.254: T.13 55.24,70.48 55.24,62.36 61.72,55.88 IC4.3 67.06,55.88 68.07,54.86 68.07,36.96 66.55,35.43 64.14,35.43 60.71,38.86 56.39,38.86 54.36,40.89 39.12,40.89 37.34,42.67 v37.34,50.42 | BUS.39 22.86,9.91 v21.34,11.43 | v18.8,13.97 17.53,15.24 v17.53,21.34 | v19.05,22.86 27.43,31.24 27.43,41.66 28.19,42.42 28.19,46.86 v27.94,47.12 | v30.73,50.16 31.37,50.16 33.91,52.7 v35.05,52.7
A7  (via drill 0.35)
  Top 0.254: IC4.6 64.77,48.64 62.48,50.93 62.48,69.6 T.15 | BUS.40 21.97,3.81 20.32,2.16 12.7,2.16 11.3,3.56 11.3,4.32 10.67,4.95 9.53,4.95 8.76,5.71 8.76,10.29 v10.79,12.32 | v13.21,16.76 14.35,17.91 25.15,17.91 28.7,21.46 28.7,21.97 29.72,22.99 32.38,22.99 33.4,24 v33.4,27.94 | v37.34,31.88 37.34,33.66 40.64,36.96 v40.64,40.13 | v63.88,36.83 v62.74,35.69 | v63.88,41.53 62.74,42.67 v62.74,44.96
  Bottom 0.254: v10.79,12.32 11.56,12.32 13.34,14.1 13.34,16.64 v13.21,16.76 | v37.34,31.88 v33.4,27.94 | v40.64,40.13 54.36,40.13 56.13,38.35 60.33,38.35 62.74,35.94 v62.74,35.69 | v63.88,41.53 v63.88,36.83 | v62.74,44.96 62.74,46.23 IC4.6
A8  (via drill 0.35)
  Top 0.254: IC3.1 60.33,31.75 v59.69,31.11 59.69,31.24 59.31,31.24 58.8,31.75 58.8,32.89 64.9,38.99 71.25,38.99 v72.64,40.39 | v59.05,20.95 59.05,20.57 v56.77,18.29 | v53.47,14.61 49.78,14.61 44.45,9.27 34.29,9.27 33.78,9.78 32.51,9.78 30.99,8.26 22.23,8.26 BUS.41 | v56.13,73.41 56.13,72.64 61.72,67.06 v61.72,62.48 | v69.34,59.82 69.34,51.69 71.63,49.4 73.41,49.4 74.17,48.64 v74.17,47.24
  Bottom 0.254: v59.69,31.11 59.69,30.61 59.05,29.97 v59.05,20.95 | v56.77,18.29 56.13,18.29 53.47,15.62 v53.47,14.61 | v56.13,73.41 T.17 | v61.72,62.48 66.67,62.48 v69.34,59.82 | v74.17,47.24 74.17,41.91 v72.64,40.39
A9  (via drill 0.35)
  Top 0.254: v62.99,34.54 64.64,36.2 64.64,37.34 65.79,38.48 71.88,38.48 73.41,40.01 73.41,40.77 73.03,41.15 64.64,41.15 64.26,40.77 63.5,40.77 61.47,42.8 v61.47,44.32 | v57.15,52.2 57.15,62.23 57.78,62.87 57.78,70.23 v55.37,72.64 | BUS.42 19.43,3.81 18.29,2.67 14.73,2.67 13.84,3.56 13.84,4.32 12.95,5.21 12.19,5.21 11.56,5.84 v11.56,14.48 | v5.59,23.24 6.73,24.38 7.37,24.38 v10.92,27.94 | v10.92,43.81 10.92,46.61 15.88,51.56 v15.88,66.29 | v28.45,78.74 30.86,78.74 31.75,79.63 49.02,79.63 50.93,77.72 50.93,76.83 52.07,75.69 T.19
  Bottom 0.254: IC3.2 64.77,29.59 62.99,31.37 v62.99,34.54 | v61.47,44.32 61.09,44.32 59.44,45.97 59.44,49.91 v57.15,52.2 | v55.37,72.64 55.37,73.15 54.74,73.79 53.21,73.79 T.19 | v11.56,14.48 11.56,16.51 5.59,22.48 v5.59,23.24 | v10.92,43.81 v10.92,27.94 | v15.88,66.29 15.88,66.67 18.54,69.34 18.54,71.25 26.04,78.74 v28.45,78.74
A10  (via drill 0.35)
  Top 0.254: IC3.3 61.72,26.67 v61.21,27.18 | v59.82,36.58 60.07,36.58 60.71,37.21 v60.71,45.85 | v53.59,62.23 53.59,61.09 | 53.59,61.09 v53.59,56.9 | BUS.43 16.89,6.35 15.75,5.21 14.73,5.21 13.97,5.97 v13.97,11.94 | v18.8,51.56 18.8,53.09 v20.45,54.74 | v41.91,60.83 41.91,62.99 42.16,63.25 42.16,64.01 v42.29,64.14 | 53.59,61.09 v51.82,61.09
  Bottom 0.254: v61.21,27.18 61.21,29.84 61.47,30.1 61.47,34.92 v59.82,36.58 | v60.71,45.85 60.71,49.78 v53.59,56.9 | v53.59,62.23 53.59,62.61 53.85,62.87 53.85,70.61 T.21 | v13.97,11.94 15.37,11.94 17.02,13.59 17.02,16.89 16,17.91 14.22,17.91 11.68,20.45 11.68,43.05 14.48,45.85 17.78,45.85 18.54,46.61 18.54,48.26 18.41,48.39 18.41,49.28 19.18,50.04 19.18,51.18 v18.8,51.56 | v20.45,54.74 21.59,54.74 27.43,60.58 41.66,60.58 v41.91,60.83 | v42.29,64.14 44.45,64.14 45.21,64.9 48.01,64.9 v51.82,61.09
A11  (via drill 0.35)
  Top 0.254: v55.12,19.43 51.94,22.61 v51.94,25.91 | v49.91,37.47 49.91,38.86 50.35,39.31 | 50.35,39.31 50.55,39.5 50.55,66.04 v50.8,66.29 | v33.78,35.69 33.78,37.47 36.32,40.01 v36.32,42.29 | 50.35,39.31 v50.55,39.12
  Bottom 0.254: IC3.6 55.5,19.05 v55.12,19.43 | v51.94,25.91 51.94,35.43 v49.91,37.47 | v50.8,66.29 50.42,66.29 46.99,69.72 T.23 | BUS.44 17.78,4.7 18.92,5.84 18.92,8.26 18.29,8.89 18.29,9.65 21.46,12.83 22.48,12.83 24.38,14.73 26.04,14.73 27.18,15.88 27.18,22.99 29.72,25.53 31.5,25.53 32.64,26.67 32.64,34.54 v33.78,35.69 | v36.32,42.29 36.96,42.29 39.88,39.37 50.29,39.37 v50.55,39.12
A12  (via drill 0.35)
  Top 0.254: IC2.1 v39.37,61.34 39.37,62.1 38.73,62.74 38.73,66.8 v38.86,66.93 | BUS.45 15.24,11.81 v12.57,14.48 | v7.75,43.69 v7.75,32
  Bottom 0.254: v38.86,66.93 38.86,69.34 T.25 | v12.57,14.48 12.57,16.26 7.75,21.08 v7.75,32 | v7.75,43.69 25.4,61.34 v39.37,61.34
A13  (via drill 0.35)
  Top 0.254: IC2.2 39.37,56.26 37.59,58.04 37.59,66.8 38.35,67.56 38.35,73.15 38.99,73.79 40.77,73.79 T.27 | v2.41,39.24 v2.41,33.27 | v19.94,60.96 22.1,60.96 24.13,58.93 v24.13,54.99
  Bottom 0.254: BUS.46 15.24,4.7 16.64,6.1 16.64,6.86 17.4,7.62 17.4,8.64 15.37,10.67 10.54,10.67 4.95,16.26 4.95,18.29 4.06,19.18 3.3,19.18 2.41,20.07 v2.41,33.27 | v2.41,39.24 2.41,43.43 v19.94,60.96 | v24.13,54.99 26.16,54.99 30.23,59.05 36.2,59.05 IC2.2
A14  (via drill 0.35)
  Top 0.254: IC2.4 39.37,51.18 37.08,53.47 37.08,53.72 | 37.08,53.72 37.08,67.06 37.85,67.82 37.85,73.41 T.29 | v2.67,18.67 3.05,18.67 3.56,19.18 4.32,19.18 13.21,28.07 17.27,28.07 20.45,31.24 v21.97,31.24 | v27.18,46.35 27.18,47.75 v29.72,50.29 | 37.08,53.72 v36.2,53.72
  Bottom 0.254: BUS.47 12.19,6.35 10.79,4.95 9.53,4.95 2.67,11.81 v2.67,18.67 | v21.97,31.24 21.97,36.96 27.69,42.67 27.69,45.85 v27.18,46.35 | v29.72,50.29 33.15,53.72 v36.2,53.72
A15  (via drill 0.35)
  Top 0.254: IC2.5 38.35,48.26 32.77,53.85 32.77,64.26 36.83,68.33 36.83,73.53 | T.31 36.83,73.53 | v32.89,73.91 33.27,73.91 33.66,73.53 36.83,73.53
  Bottom 0.254: BUS.48 11.81,3.81 10.67,2.67 9.65,2.67 1.14,11.18 1.14,52.7 18.03,69.6 18.03,71.5 26.04,79.5 28.83,79.5 30.61,77.72 30.61,76.96 31.5,76.07 32.26,76.07 32.89,75.44 v32.89,73.91
BAUDCLK
  Top 0.254: TRG.6 TRG.4 TRG.2 16.13,77.47 21.59,72.01 Y1.8
CLK  (via drill 0.35)
  Top 0.254: TRG.8 8.51,77.47 11.68,80.64 v27.18,80.64 | v32.13,78.87 34.92,78.87 35.69,78.11 35.69,76.96 36.32,76.33 38.23,76.33 T.30 | v51.94,12.57 v49.78,12.57 | v64.9,11.43 66.04,11.43 BUS.1 | v41.78,73.41 42.04,73.41 45.09,70.36 46.86,70.36 47.37,70.87 48.13,70.87 48.51,70.48 48.51,63.88 47.88,63.25 47.88,60.07 50.04,57.91 50.04,39.75 48.64,38.35 v48.64,36.07 | v49.78,27.69 49.78,26.8 49.15,26.16 v49.15,23.24
  Bottom 0.254: v27.18,80.64 30.35,80.64 v32.13,78.87 | IC1.15 36.83,13.97 38.23,12.57 v49.78,12.57 49.78,22.61 v49.15,23.24 | v51.94,12.57 52.83,11.68 64.64,11.68 v64.9,11.43 | T.30 39.37,76.58 40.77,75.18 40.77,74.42 v41.78,73.41 | v48.64,36.07 48.64,34.04 49.78,32.89 v49.78,27.69
D0  (via drill 0.35)
  Top 0.254: v34.16,23.62 34.16,28.32 33.02,29.46 33.02,37.59 31.24,39.37 IC1.25 v28.7,41.15 | v42.16,21.34 42.16,17.14 41.91,16.89 41.91,12.45 41.66,12.19 v41.66,10.03 | T.2 74.04,77.47 70.23,81.28 29.84,81.28 27.69,79.12 27.69,78.11 27.81,77.98 v27.81,55.5 | v26.92,52.83 26.92,50.8 26.42,50.29 v26.42,47.62
  Bottom 0.254: v34.16,23.62 37.72,23.62 38.35,22.99 40.51,22.99 v42.16,21.34 | v41.66,10.03 41.66,9.65 40.64,8.64 BUS.25 | v27.81,55.5 27.81,53.72 v26.92,52.83 | v26.42,47.62 27.3,47.62 27.56,47.88 28.32,47.88 28.7,47.5 v28.7,41.15
D1  (via drill 0.35)
  Top 0.254: v26.42,21.59 v26.42,26.67 | v26.42,16.26 26.42,14.73 v27.43,13.72 | T.4 73.28,77.47 74.68,76.07 75.44,76.07 81.03,70.48 81.03,10.29 v74.3,3.56 | v37.21,1.91 38.73,1.91 BUS.26
  Bottom 0.254: IC1.26 30.48,41.53 27.94,38.99 27.94,28.19 v26.42,26.67 | v26.42,16.26 v26.42,21.59 | v27.43,13.72 28.57,12.57 31.75,12.57 36.45,7.87 36.45,7.11 36.96,6.6 36.96,5.84 37.85,4.95 39.5,4.95 BUS.26 | v74.3,3.56 71.88,1.14 37.97,1.14 v37.21,1.91
D2  (via drill 0.35)
  Top 0.254: v21.84,14.22 23.62,12.45 24.89,12.45 v25.53,11.81 | v32.13,5.21 36.96,5.21 BUS.27 | v47.75,70.1 47.75,67.44 43.18,62.87 43.18,51.05 42.93,50.8 42.93,46.61 45.21,44.32 45.21,40.39 44.32,39.5 v44.32,37.59 | IC1.27 v35.05,39.88
  Bottom 0.254: IC1.27 30.48,44.07 32.26,42.29 32.26,38.99 31.5,38.23 29.34,38.23 28.45,37.34 28.45,27.56 21.84,20.95 v21.84,14.22 | v25.53,11.81 26.29,11.05 26.29,9.65 29.34,6.6 29.34,5.84 29.97,5.21 v32.13,5.21 | T.6 67.69,79.63 60.2,79.63 58.29,77.72 58.29,76.96 57.4,76.07 49.02,76.07 48.13,75.18 48.13,70.48 v47.75,70.1 | v44.32,37.59 43.94,37.59 43.69,37.85 37.08,37.85 v35.05,39.88
D3  (via drill 0.35)
  Top 0.254: v32.77,44.7 32.77,43.56 v35.43,40.89 | v52.7,27.43 v50.67,29.46 | v69.72,69.34 69.72,64.39 v71.25,62.87 | v71.25,33.66 70.99,33.66 70.23,32.89 60.33,32.89 v59.56,32.13
  Bottom 0.254: v32.77,44.7 IC1.28 | v35.43,40.89 36.2,40.89 38.73,38.35 47.5,38.35 50.42,35.43 50.42,29.72 v50.67,29.46 | BUS.28 39.24,2.67 41.15,2.67 41.78,3.3 41.78,4.32 41.15,4.95 40.39,4.95 39.5,5.84 39.5,9.53 40.77,10.79 49.15,10.79 50.55,12.19 50.55,12.32 52.7,14.48 v52.7,27.43 53.09,27.81 57.4,27.81 58.29,28.7 58.29,30.86 v59.56,32.13 | T.8 67.31,76.58 68.71,75.18 68.71,70.36 v69.72,69.34 | v71.25,62.87 73.03,62.87 79.88,56.01 79.88,42.29 v71.25,33.66
D4  (via drill 0.35)
  Top 0.254: v17.78,46.99 17.78,39.12 v19.94,36.96 | v19.81,19.3 v19.81,27.18 | v20.95,14.86 20.95,13.97 23.24,11.68 v23.37,11.68 | T.10 63.88,77.47 62.48,76.07 61.72,76.07 60.83,75.18 60.83,74.42 59.94,73.53 v59.69,73.53 | v63.5,8.51 63.5,8 62.23,6.73 v62.23,4.57
  Bottom 0.254: v17.78,46.99 IC1.1 | v19.94,36.96 19.94,29.97 20.32,29.59 20.32,27.69 v19.81,27.18 | v19.81,19.3 19.81,16 v20.95,14.86 | v23.37,11.68 23.37,7.49 24.26,6.6 24.26,5.84 25.15,4.95 25.91,4.95 26.8,4.06 26.8,3.3 27.43,2.67 33.53,2.67 34.42,3.56 34.42,4.45 35.5,5.52 | 35.5,5.52 35.56,5.59 BUS.29 | v59.69,73.53 59.69,73.15 55.75,69.22 55.75,62.61 61.34,57.02 66.67,57.02 68.58,55.12 68.58,20.83 68.33,20.57 68.33,12.95 63.88,8.51 v63.5,8.51 | v62.23,4.57 62.23,3.43 60.45,1.65 38.61,1.65 36.7,3.56 36.7,4.32 35.5,5.52
D5  (via drill 0.35)
  Top 0.254: IC1.2 15.24,44.07 13.46,42.29 13.46,38.99 13.72,38.73 13.72,37.85 13.21,37.34 13.21,35.31 v13.46,35.05 | v19.05,9.27 v19.05,12.95 | T.12 61.34,77.47 59.18,79.63 v55.24,79.63 | v40.51,76.58 40.13,76.58 39.62,76.07 38.86,76.07 37.97,75.18 37.97,74.3 37.34,73.66 37.34,68.07 33.53,64.26 v33.53,58.29 | v21.46,50.16 21.08,50.16 19.68,48.77 v19.18,48.77
  Bottom 0.254: v13.46,35.05 13.46,23.75 14.48,22.73 17.27,22.73 19.05,20.95 19.05,16 19.68,15.37 19.68,13.59 v19.05,12.95 | v19.05,9.27 21.72,6.6 21.72,5.84 22.61,4.95 23.37,4.95 24.26,4.06 24.26,3.3 25.4,2.16 33.91,2.16 BUS.30 | v55.24,79.63 42.42,79.63 40.51,77.72 v40.51,76.58 | v33.53,58.29 25.4,50.16 v21.46,50.16 | v19.18,48.77 19.18,46.48 17.14,44.45 IC1.2
D6  (via drill 0.35)
  Top 0.254: v13.34,20.19 17.4,20.19 v18.29,19.3 | v18.92,14.99 23.88,10.03 26.67,10.03 v27.05,10.41 | v55.12,71.5 55.12,66.42 51.82,63.12 v51.82,62.23 | v43.81,70.23 40.64,70.23 v39.62,71.25 | v36.07,69.72 36.07,68.33 29.21,61.47 v29.21,59.82 | v22.73,54.74 22.73,52.58 20.57,50.42 v18.41,50.42 | v17.02,48.64 17.02,43.69 IC1.3
  Bottom 0.254: IC1.3 12.19,38.86 12.19,21.34 v13.34,20.19 | v18.29,19.3 18.29,15.62 v18.92,14.99 | v27.05,10.41 27.69,11.05 28.45,11.05 33.02,6.48 BUS.31 | T.14 59.69,76.58 58.29,75.18 58.29,74.42 55.37,71.5 v55.12,71.5 | v43.81,70.23 v51.82,62.23 | v39.62,71.25 37.59,71.25 v36.07,69.72 | v29.21,59.82 27.81,59.82 v22.73,54.74 | v18.41,50.42 18.41,50.04 v17.02,48.64
D7  (via drill 0.35)
  Top 0.254: IC1.4 16.38,39.37 v18.03,37.72 | v20.57,26.42 20.57,22.1 v23.37,19.3 | v23.37,14.86 23.37,13.84 v24,13.21 | v24.51,7.49 24.51,7.11 24.26,6.86 24.26,5.84 25.15,4.95 31.24,4.95 32.38,3.81 BUS.32 | v80.26,66.17 v74.93,71.5 | v75.69,22.73 68.2,22.73 v67.82,22.35 | v42.42,8.51 40.89,8.51 40.64,8.76 33.66,8.76 v33.4,9.02
  Bottom 0.254: v18.03,37.72 20.32,37.72 20.7,37.34 20.7,29.97 20.83,29.84 20.83,26.67 v20.57,26.42 | v23.37,14.86 v23.37,19.3 | v24,13.21 24,12.19 24.13,12.06 24.13,7.87 v24.51,7.49 | T.16 59.82,80.14 68.83,80.14 71.25,77.72 71.25,74.42 74.17,71.5 v74.93,71.5 | v80.26,66.17 80.26,61.21 81.03,60.45 81.03,28.07 v75.69,22.73 | v67.82,22.35 67.82,13.21 64.39,9.78 49.66,9.78 48.39,8.51 v42.42,8.51 | v33.4,9.02 33.4,7.62 34.16,6.86 34.16,4.95 BUS.32
E0H
  Top 0.254: IC4.9 69.47,43.18 65.53,47.12 58.29,47.12 CSLB.1
F0H
  Top 0.254: IC4.7 61.98,45.72 61.09,46.61 58.04,46.61 CSLB.3
F8H
  Top 0.254: IC3.15 66.93,29.21 65.79,30.35 58.29,30.35 CSHB.1
F9H
  Top 0.254: IC3.14 68.33,26.67 68.2,26.54 67.06,26.54 65.66,27.94 58.42,27.94 CSHB.3
FAH
  Top 0.254: IC3.13 66.93,24.13 65.79,25.27 58.29,25.27 CSHB.5
FBH
  Top 0.254: IC3.12 67.44,21.59 66.29,22.73 58.29,22.73 CSHB.7
GND  (via drill 0.35)
  Top 0.508: Y1.7 21.59,53.34 C1.1 | IC5.13 IC5.12 | IC5.2 IC5.1 40.64,30.48 C5.1 41.78,35.43 41.78,40.77 IC2.7 39.75,43.05 v41.66,44.96 | IC5.7 39.12,13.97 37.21,15.88 | 37.21,15.88 37.21,17.14 39.12,19.05 IC5.5 IC5.4 | v16.38,8.13 20.83,8.13 21.84,9.14 29.08,9.14 35.69,15.75 37.08,15.75 37.21,15.88 | IC2.9 IC2.10 46.86,48.39 46.61,48.39 44.83,50.16 44.83,51.44 46.86,53.47 IC2.12 IC2.13 | IC3.8 65.66,13.97 72.64,6.99 72.64,5.33 BUS.2 | C4.1 66.04,62.48 67.06,61.47 v67.06,54.36 | v70.1,34.29 68.58,34.29 C3.1
  Bottom 0.508: IC1.5 15.49,36.83 20.32,41.66 20.32,48.77 | C1.1 20.32,48.77 | IC5.2 IC5.13 | BUS.49 10.54,6.35 12.32,8.13 v16.38,8.13 | IC5.12 46.61,24.13 41.53,19.05 IC5.5 | 20.32,48.77 31.5,48.77 33.91,46.35 33.91,39.37 38.99,34.29 C5.1 | IC2.13 46.74,55.88 44.7,57.91 44.7,60.45 42.67,62.48 42.29,62.48 41.27,63.5 C2.1 34.29,69.85 T.33 | C3.1 66.04,41.91 IC4.8 | v67.06,54.36 67.06,45.21 65.02,43.18 IC4.8 | BUS.2 71.12,4.19 72.64,5.71 72.64,10.92 70.1,13.46 v70.1,34.29 | IC4.8 54.99,43.18 52.45,45.72 IC2.9 46.23,44.96 v41.66,44.96
  pour Bottom: -1.27,85.09 -1.27,-1.27 83.82,-1.27 83.82,85.09
IEI
  Bottom 0.254: IC1.13 14.86,16.51 9.02,22.35 9.02,32.64 6.1,35.56 C.4
IEO  (via drill 0.35)
  Top 0.254: IC1.11 8.64,21.59 v8.51,21.46
  Bottom 0.254: v8.51,21.46 8.51,32.38 7.87,33.02 C.5 1.65,35.18 1.65,43.43 19.05,60.83 19.05,70.99 22.99,74.93 T.39
TO0
  Top 0.254: IC1.7 9.65,31.75 5.84,27.94 C.7
TO1
  Top 0.254: IC1.8 11.05,29.21 6.73,24.89 5.84,24.89 C.9
TO2
  Top 0.254: IC1.9 13.46,26.67 9.02,22.23 8.13,22.23 3.81,17.91 C.11
TRG0
  Top 0.254: 20.7,34.29 17.4,34.29 16,32.89 9.78,32.89 7.37,30.48 C.6 | 20.7,34.29 IC1.23 | TRG.1 15.24,68.07 17.65,65.66 17.65,49.15 20.7,46.1 20.7,34.29
TRG1
  Top 0.254: IC1.22 22.61,31.75 22.35,32 17.65,32 16,30.35 11.43,30.35 6.48,25.4 C.8 1.65,27.56 1.65,43.43 7.62,49.4 7.62,67.06 12.7,72.14 TRG.3
TRG2  (via drill 0.35)
  Top 0.254: v10.16,68.45 10.16,51.18 2.67,43.69 2.67,40.13 3.3,39.5 4.45,39.5 5.21,38.73 v5.21,31.24 | C.10 v6.6,23.11
  Bottom 0.254: IC1.21 30.48,28.83 22.61,20.95 22.61,13.84 22.1,13.34 20.57,13.34 18.41,11.18 10.79,11.18 5.46,16.51 5.46,18.67 C.10 | v10.16,68.45 TRG.5 | v5.21,31.24 5.21,24.77 6.6,23.37 v6.6,23.11
TRG3  (via drill 0.35)
  Top 0.254: v24.89,17.02 21.84,17.02 21.46,17.4 18.29,17.4 16.13,15.24 C.12 1.14,17.91 1.14,63.88 7.62,70.36 TRG.7
  Bottom 0.254: IC1.20 30.1,26.67 24.89,21.46 v24.89,17.02
VCC  (via drill 0.35)
  Top 0.508: IC4.16 72.39,64.77 C4.2 | IC3.16 72.39,35.56 C3.2 | BUS.24 43.56,3.81 45.09,2.29 v70.23,2.29 | C2.2 46.99,62.23 IC2.14 47.12,58.55 49.15,56.52 49.15,42.55 45.72,39.12 C5.2 | IC1.24 29.59,36.83 25.27,41.15 25.27,51.94 C1.2 25.27,52.2 25.27,59.31 16.26,68.33 v16.26,69.34 | v39.5,31.24 39.5,32 v38.35,33.15
  Bottom 0.508: v70.23,2.29 71.75,2.29 73.15,3.68 73.15,4.7 74.55,6.1 74.55,29.84 72.64,31.75 IC3.16 | IC4.16 72.14,60.96 69.98,58.8 69.98,37.97 C3.2 | Y1.14 12.19,67.31 15.24,70.36 | 15.24,70.36 26.67,81.79 30.86,81.79 34.29,78.36 | T.34 34.29,78.36 | 46.99,31.24 46.99,33.02 C5.2 | 46.99,31.24 IC5.14 | C.3 9.78,44.07 9.78,44.32 19.05,53.59 23.88,53.59 C1.2 | v39.5,31.24 46.99,31.24 | v38.35,33.15 37.97,33.15 34.29,36.83 IC1.24 | v16.26,69.34 15.24,70.36 | C4.2 76.45,71.37 76.45,78.11 72.9,81.66 37.59,81.66 34.29,78.36
  pour Top: -1.27,85.09 -1.27,-1.27 83.82,-1.27 83.82,85.09

### Text on the board
tNames: CLK | BCLK | BCLK | BCLK | D0 | !CSHB | !CSLB | !CS | VCC | !HALT | CLK | !MREQ | !M1 | !RESET | !IORQ | !WR | !RD | D7 | D6 | D5 | D4 | D3 | D2 | D1 | 3 | 2 | 1 | 0 | IEO | !INT | A15 | A14 | A13 | A12 | A11 | A10 | A9 | A8 | A7 | A6 | A5 | A4 | A3 | A2 | A1 | A0 | !CINT | GND | 74HCT00 | E0 | 74HCT138 | F0 | !INT | !CINT | VCC | CTC | IEI | IEO | TRG0 | F8 | TO0 | F9 | TRG1 | F8 | FA | TO1 | F9 | FB | RABS664 Amstrad CPC Z80 CTC V2.0 | TRG2 | FA | 74HCT138 | TO2 | 74HCT32 | FB | TRG3